# Altium schematic sheet [2]-INTERFACE_CONNS.SchDoc: [2]-INTERFACE_CONNS
size A3; DocumentNumber: NA; Revision: 2019.01.18; SheetNumber: 2; SheetTotal: 3
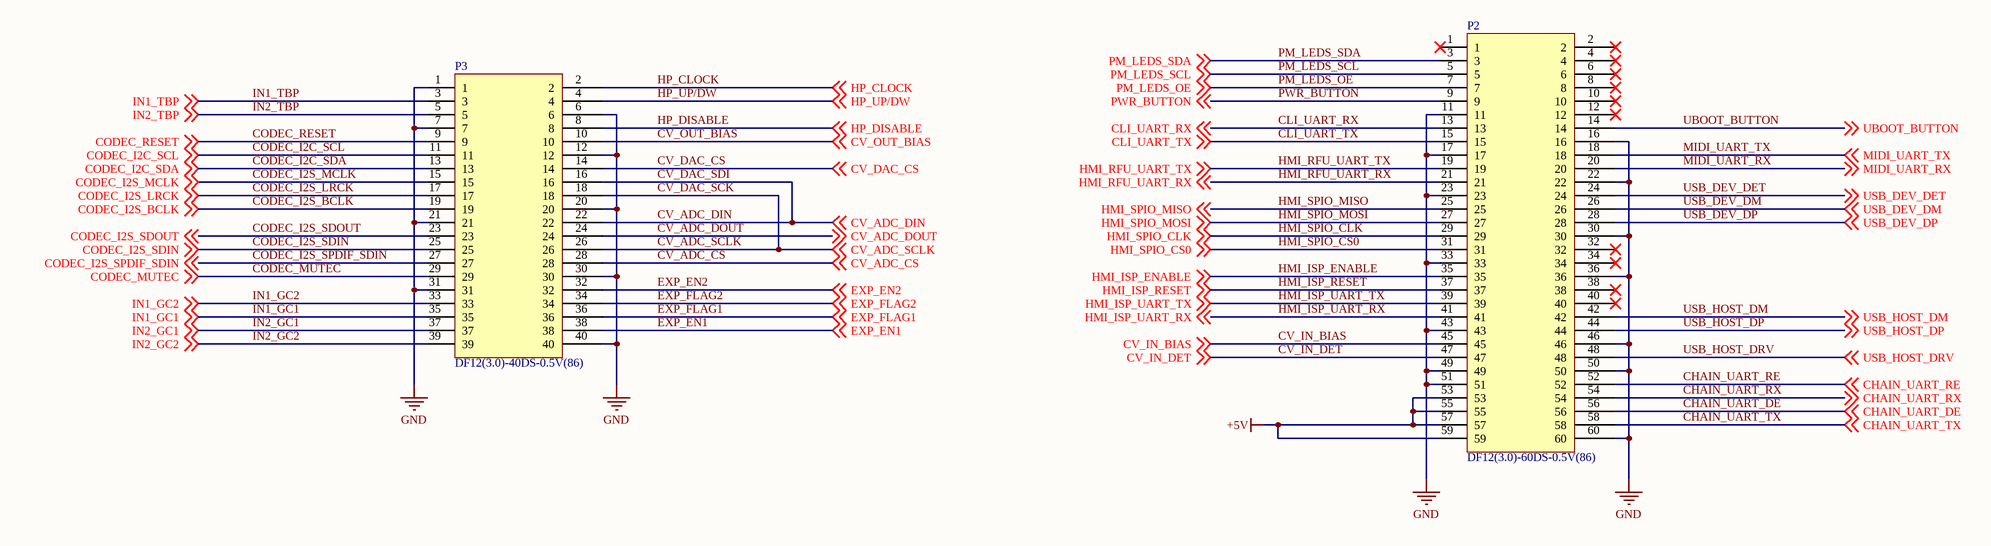
[diagram p0: [2]-INTERFACE_CONNS.SchDoc]

## Parts
P2  DF12(3.0)-60DS-0.5V(86)  [DF12-60]
P3  DF12(3.0)-40DS-0.5V(86)  [DF12-40]

## Nets
+5V: P2.53 P2.55 P2.57 P2.59
GND: P2.11 P2.16 P2.17 P2.22 P2.23 P2.30 P2.33 P2.36 P2.43 P2.46 P2.49 P2.50 P2.51 P2.60 P3.1 P3.6 P3.7 P3.12 P3.20 P3.21 P3.30 P3.31 P3.40
CHAIN_UART_DE: P2.56 ; off-sheet CHAIN_UART_DE
CHAIN_UART_RE: P2.52 ; off-sheet CHAIN_UART_RE
CHAIN_UART_RX: P2.54 ; off-sheet CHAIN_UART_RX
CHAIN_UART_TX: P2.58 ; off-sheet CHAIN_UART_TX
CLI_UART_RX: P2.13 ; off-sheet CLI_UART_RX
CLI_UART_TX: P2.15 ; off-sheet CLI_UART_TX
CODEC_I2C_SCL: P3.11 ; off-sheet CODEC_I2C_SCL
CODEC_I2C_SDA: P3.13 ; off-sheet CODEC_I2C_SDA
CODEC_I2S_BCLK: P3.19 ; off-sheet CODEC_I2S_BCLK
CODEC_I2S_LRCK: P3.17 ; off-sheet CODEC_I2S_LRCK
CODEC_I2S_MCLK: P3.15 ; off-sheet CODEC_I2S_MCLK
CODEC_I2S_SDIN: P3.25 ; off-sheet CODEC_I2S_SDIN
CODEC_I2S_SDOUT: P3.23 ; off-sheet CODEC_I2S_SDOUT
CODEC_I2S_SPDIF_SDIN: P3.27 ; off-sheet CODEC_I2S_SPDIF_SDIN
CODEC_MUTEC: P3.29 ; off-sheet CODEC_MUTEC
CODEC_RESET: P3.9 ; off-sheet CODEC_RESET
CV_ADC_CS: P3.28 ; off-sheet CV_ADC_CS
CV_ADC_DIN: P3.16 P3.22 ; off-sheet CV_ADC_DIN  [also labelled CV_DAC_SDI]
CV_ADC_DOUT: P3.24 ; off-sheet CV_ADC_DOUT
CV_ADC_SCLK: P3.18 P3.26 ; off-sheet CV_ADC_SCLK  [also labelled CV_DAC_SCK]
CV_DAC_CS: P3.14 ; off-sheet CV_DAC_CS
CV_IN_BIAS: P2.45 ; off-sheet CV_IN_BIAS
CV_IN_DET: P2.47 ; off-sheet CV_IN_DET
CV_OUT_BIAS: P3.10 ; off-sheet CV_OUT_BIAS
EXP_EN1: P3.38 ; off-sheet EXP_EN1
EXP_EN2: P3.32 ; off-sheet EXP_EN2
EXP_FLAG1: P3.36 ; off-sheet EXP_FLAG1
EXP_FLAG2: P3.34 ; off-sheet EXP_FLAG2
HMI_ISP_ENABLE: P2.35 ; off-sheet HMI_ISP_ENABLE
HMI_ISP_RESET: P2.37 ; off-sheet HMI_ISP_RESET
HMI_ISP_UART_RX: P2.41 ; off-sheet HMI_ISP_UART_RX
HMI_ISP_UART_TX: P2.39 ; off-sheet HMI_ISP_UART_TX
HMI_RFU_UART_RX: P2.21 ; off-sheet HMI_RFU_UART_RX
HMI_RFU_UART_TX: P2.19 ; off-sheet HMI_RFU_UART_TX
HMI_SPIO_CLK: P2.29 ; off-sheet HMI_SPIO_CLK
HMI_SPIO_CS0: P2.31 ; off-sheet HMI_SPIO_CS0
HMI_SPIO_MISO: P2.25 ; off-sheet HMI_SPIO_MISO
HMI_SPIO_MOSI: P2.27 ; off-sheet HMI_SPIO_MOSI
HP_CLOCK: P3.2 ; off-sheet HP_CLOCK
HP_DISABLE: P3.8 ; off-sheet HP_DISABLE
HP_UP/DW: P3.4 ; off-sheet HP_UP/DW
IN1_GC1: P3.35 ; off-sheet IN1_GC1
IN1_GC2: P3.33 ; off-sheet IN1_GC2
IN1_TBP: P3.3 ; off-sheet IN1_TBP
IN2_GC1: P3.37 ; off-sheet IN2_GC1
IN2_GC2: P3.39 ; off-sheet IN2_GC2
IN2_TBP: P3.5 ; off-sheet IN2_TBP
MIDI_UART_RX: P2.20 ; off-sheet MIDI_UART_RX
MIDI_UART_TX: P2.18 ; off-sheet MIDI_UART_TX
PM_LEDS_OE: P2.7 ; off-sheet PM_LEDS_OE
PM_LEDS_SCL: P2.5 ; off-sheet PM_LEDS_SCL
PM_LEDS_SDA: P2.3 ; off-sheet PM_LEDS_SDA
PWR_BUTTON: P2.9 ; off-sheet PWR_BUTTON
UBOOT_BUTTON: P2.14 ; off-sheet UBOOT_BUTTON
USB_DEV_DET: P2.24 ; off-sheet USB_DEV_DET
USB_DEV_DM: P2.26 ; off-sheet USB_DEV_DM
USB_DEV_DP: P2.28 ; off-sheet USB_DEV_DP
USB_HOST_DM: P2.42 ; off-sheet USB_HOST_DM
USB_HOST_DP: P2.44 ; off-sheet USB_HOST_DP
USB_HOST_DRV: P2.48 ; off-sheet USB_HOST_DRV

Not connected (* = marked no-connect by the designer): P2 1* 2* 4* 6* 8* 10* 12* 32* 34* 38* 40*

## Library data of the parts
P2 = DF12(3.0)-60DS-0.5V(86): CONN RECEPT 60POS 3MM SMD 0.5MM; Manufacturer 1: Hirose; Number of Contacts: 60; Current Rating: 300mA; Voltage Rating: 50V; Gender: Receptacle; Contact Resistance: 50mR; Mating Cycles: 50; Insulation Resistance: 500MR; Row Spacing: 2.4mm; Supplier 1: Digi-Key; Manufacturer Part Number 1: DF12(3.0)-60DS-0.5V(86); Stock 1: 7229; Pricing 1: 1=1.87, 10=1.698, 25=1.594, 50=1.5246, 100=1.4553, 250=1.31672, 500=1.21276 (USD); Mount: Surface Mount; Contact Plating: Gold; Contact Material: Copper,Copper Alloy; Housing Colour: Beige; Housing Material: Polyamide; Insulation Material: Nylon; Colour: Beige; Min Operating Temperature: -45°C; Max Operating Temperature: 125°C; Number of Rows: 2; Termination: Solder; Packaging: Tape and Reel; Package Quantity: 1; Number of Positions: 60; Orientation: Straight; Max Current Rating: 300mA; Max Voltage Rating (AC): 50V; Voltage Rating (AC): 50V; Connector Type: Receptacle; Length: 18mm; Pitch: 0.5mm; Stack Height: 3mm; Mated Stacking Heights: 3mm; Depth: 3.6mm; Lead Pitch: 0.5mm; Width: 18mm; Radiation Hardening: No; Flammability Rating: UL94 V-0; REACH SVHC: No SVHC; Lead Free: Lead Free; Supplier Part Number 1: H5207CT-ND
P3 = DF12(3.0)-40DS-0.5V(86): CONN RECEPT 40POS 3MM SMD 0.5MM; Manufacturer 1: Hirose; Number of Contacts: 40; Current Rating: 300mA; Voltage Rating: 50V; Gender: Receptacle; Contact Resistance: 50mR; Row Spacing: 2.4mm; Supplier 1: Digi-Key; Manufacturer Part Number 1: DF12(3.0)-40DS-0.5V(86); Stock 1: 9904; Pricing 1: 1=1.44, 10=1.262, 25=1.188, 50=1.1386, 100=1.089, 250=0.99, 500=0.891 (USD); Mount: Surface Mount; Contact Plating: Gold; Contact Material: Copper; Housing Colour: Beige; Housing Material: Polyamide; Insulation Material: Nylon; Min Operating Temperature: -45°C; Max Operating Temperature: 125°C; Number of Rows: 2; Termination: SMD/SMT; Packaging: Tape and Reel; Package Quantity: 1000; Number of Positions: 40; Orientation: Straight; Connector Type: Receptacle; Max Current Rating: 300mA; Max Voltage Rating (AC): 50V; Length: 13mm; Pitch: 0.5mm; Mated Stacking Heights: 3mm; Stack Height: 3mm; Depth: 3.6mm; Radiation Hardening: No; Lead Free: Lead Free; Flammability Rating: UL94 V-0; REACH SVHC: No SVHC; Supplier Part Number 1: H11706CT-ND